# EAGLE schematic LNA (EAGLE 8.5.2)
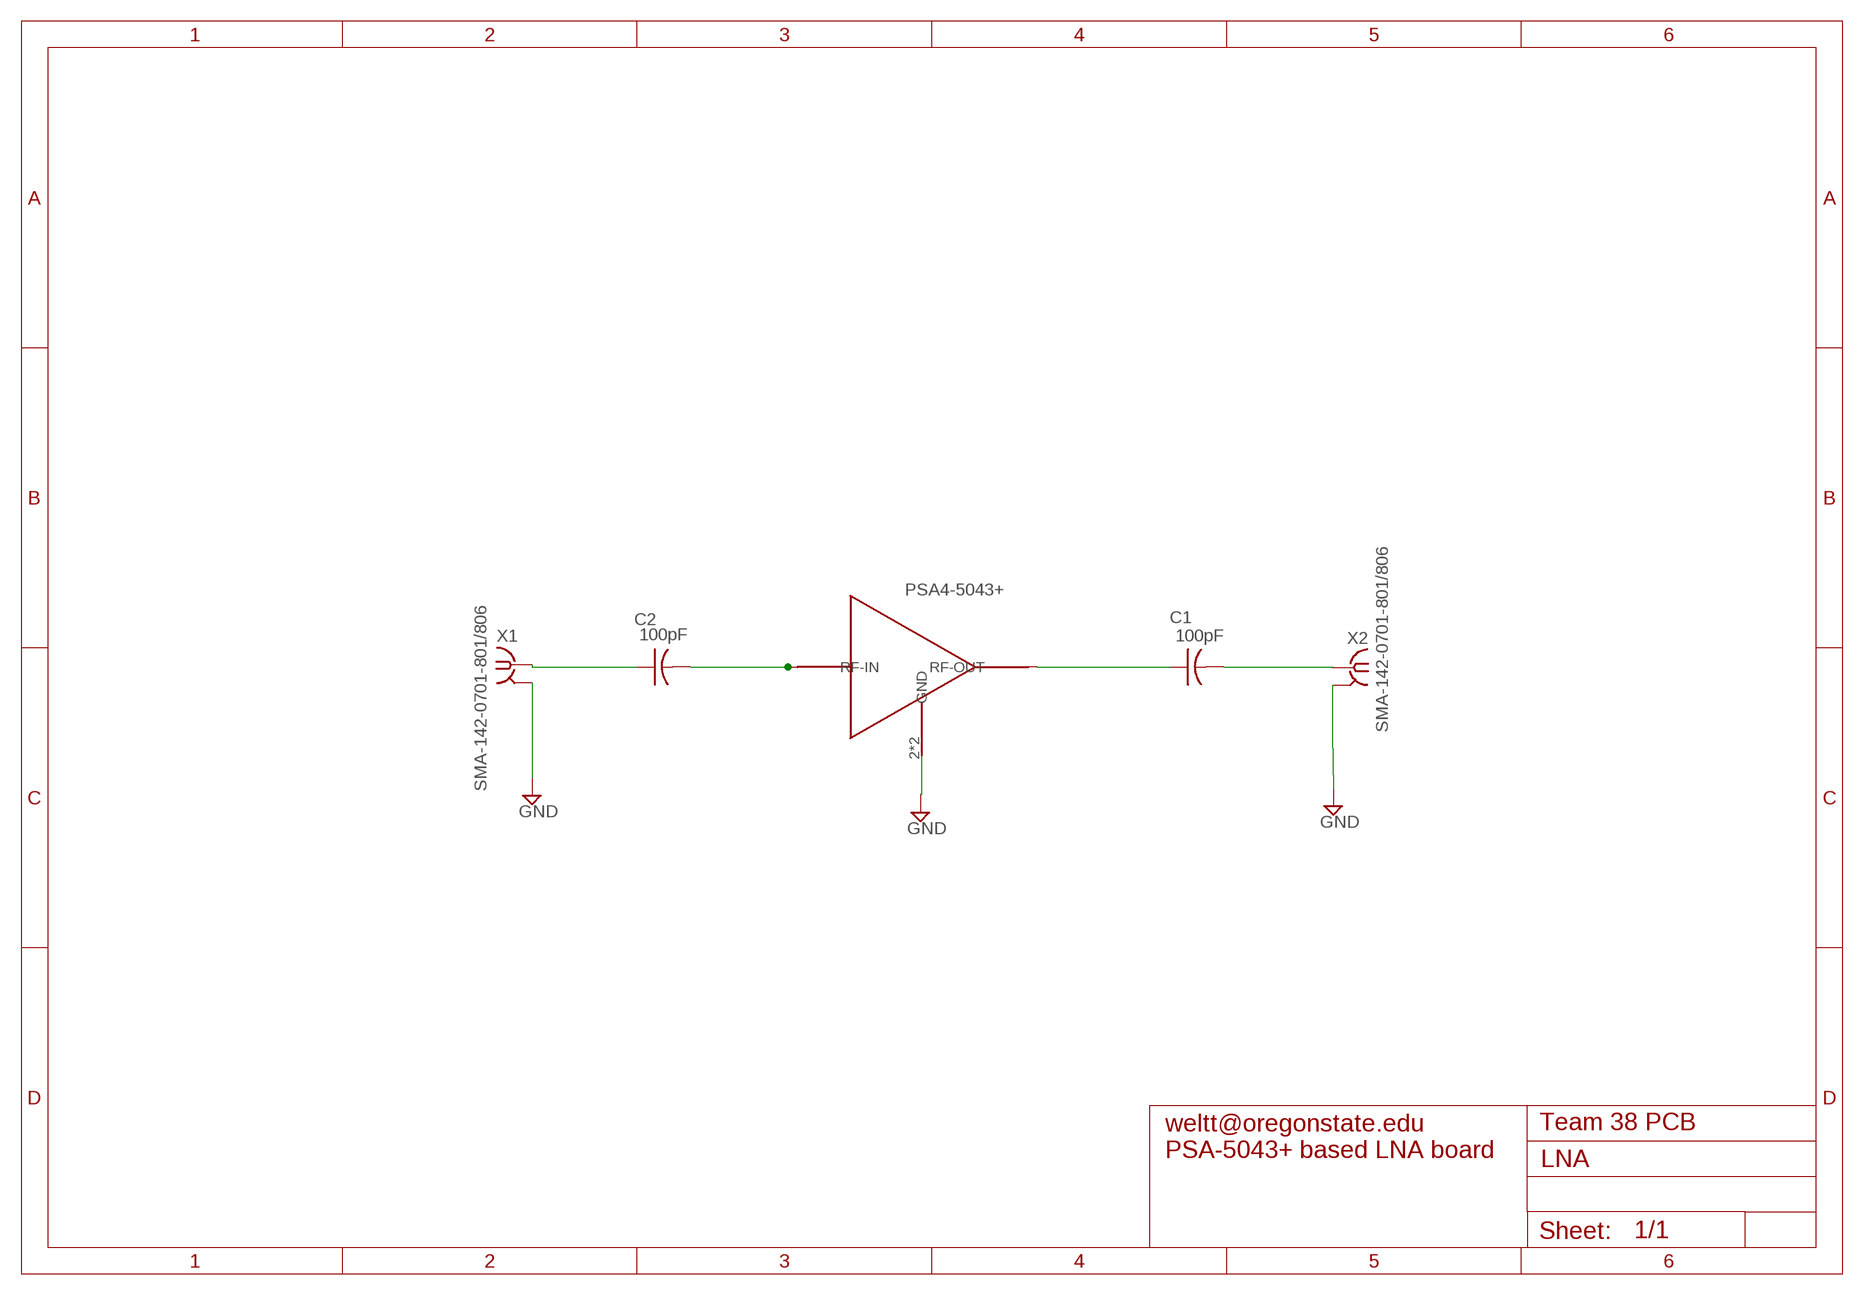
[diagram p0: schematic, sheet 1]

## Parts
C1  100pF  C-USC0402K  [C0402K]
C2  100pF  C-USC0402K  [C0402K]
MMM1362  PSA4-5043+  [PSA4-5043+]
X1  SMA-142-0701-801/806  [J502-ND-142-0701-801/806]
X2  SMA-142-0701-801/806  [J502-ND-142-0701-801/806]

## Nets
GND: MMM1362.2(GND) MMM1362.4(GND) X1.G@1 X1.G@2 X1.G@3 X1.G@4 X2.G@1 X2.G@2 X2.G@3 X2.G@4
N$1: C2.2 MMM1362.3(RF-IN)
N$2: C1.1 MMM1362.1(RF-OUT)
N$3: C2.1 X1.1
N$4: C1.2 X2.1

## Notes on the sheet
- Team 38 PCB
- weltt@oregonstate.edu
  PSA-5043+ based LNA board

## Library data of the parts
C1 C2 = rcl:C-US: CAPACITOR, American symbol
MMM1362 = PSA4-5043_:PSA4-5043+; AVAILABILITY: Unavailable; DESCRIPTION: Ultra Low Noise MMIC Amplifier, 50ohm, 0.05 to 4 GHz; MF: Mini-Circuits; MP: PSA4-5043+; PACKAGE: MMM1362; PRICE: 2.50; SPICEPREFIX: M
X1 X2 = con-coax:SMA-: SMA 50 Ohm End Launch Jack Receptacle - Round Contact Johnson Components Source: www.johnsoncomponents.com .. J502-ND.pdf; MF: JOHNSON COMPONENTS; MPN: 142-0701-801; OC_FARNELL: 1608592; OC_NEWARK: 90F2624